# Altium schematic sheet ADC.SchDoc: Wearable ECG Signal Acquisition Device
size A4; DrawnBy: Sineth Jayawardena; Address1: 003 18 bit SAR ADC; Revision: V1; SheetNumber: 4; SheetTotal: 5
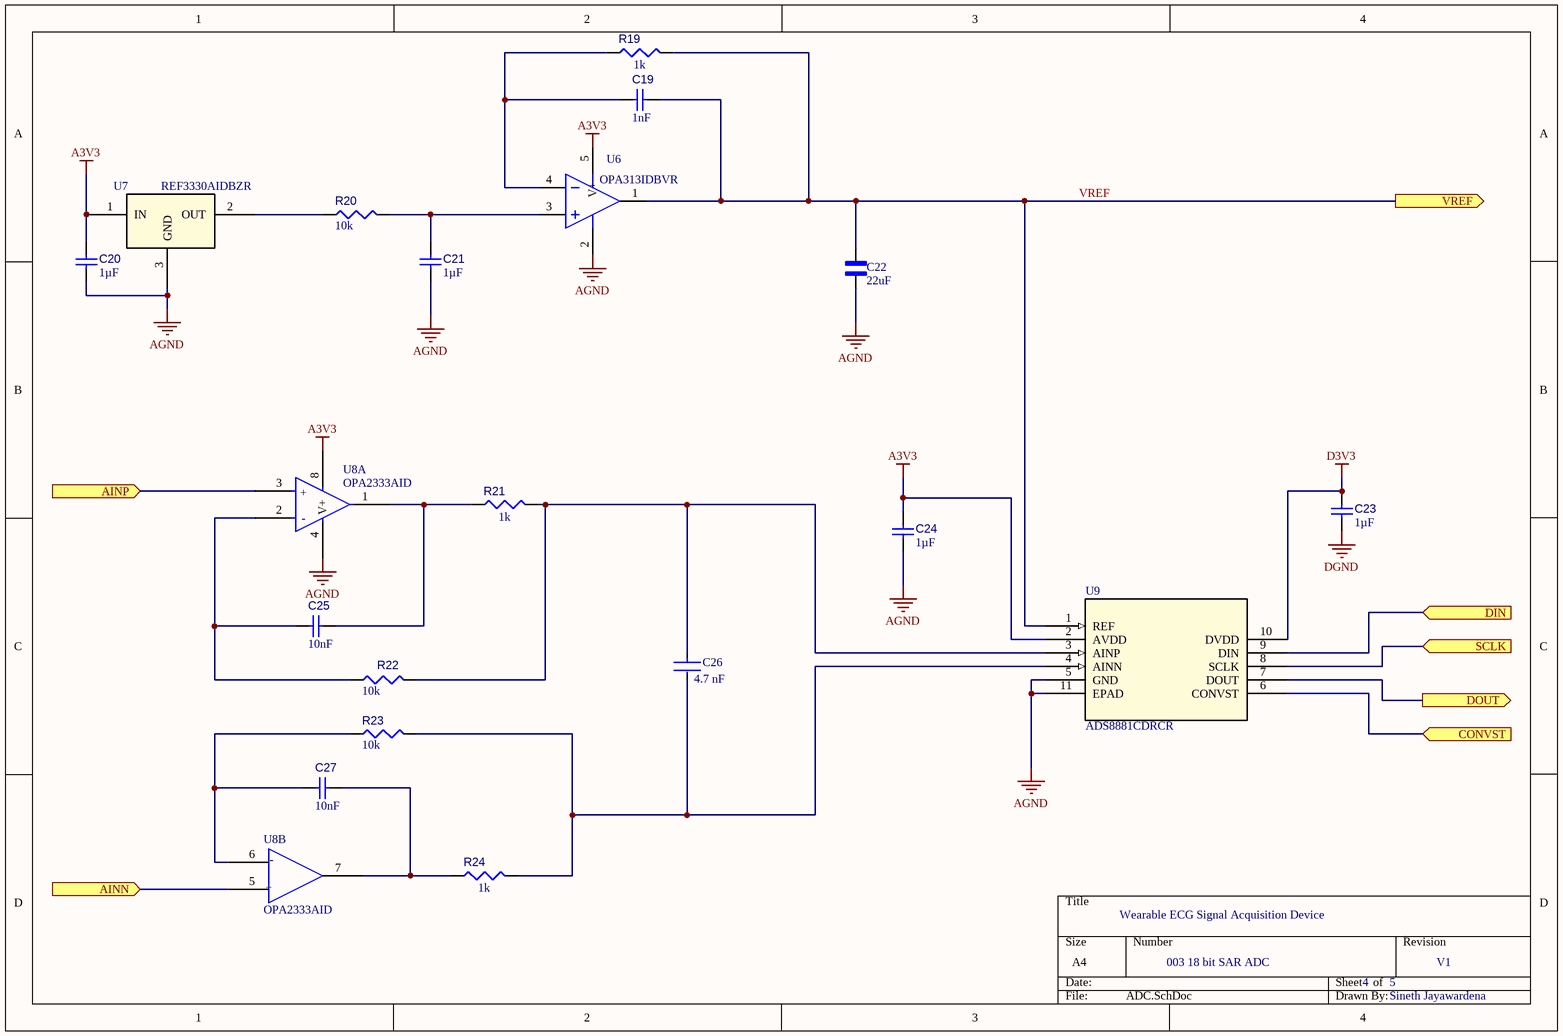
[diagram p0: ADC.SchDoc]

## Parts
C19  value 1nF  [CAPC0402(1005)33_L]  (hidden comment: Capacitor 1nF +/-20% 50V 0402)
C20  value 1µF  [CAPC2013X145X50ML20T25]  (hidden comment: Capacitor 1 uF +/- 10% 25 V 0805)
C21  value 1µF  [CAPC2013X145X50ML20T25]  (hidden comment: Capacitor 1 uF +/- 10% 25 V 0805)
C22  22uF  [22uF_CAPC1608X100N]
C23  value 1µF  [CAPC2013X145X50ML20T25]  (hidden comment: Capacitor 1 uF +/- 10% 25 V 0805)
C24  value 1µF  [CAPC2013X145X50ML20T25]  (hidden comment: Capacitor 1 uF +/- 10% 25 V 0805)
C25  value 10nF  [CAPC0402(1005)60_L]  (hidden comment: Capacitor 10nF +/-20% 50V 0402)
C26  value 4.7 nF  [FP-AC0805-0_85-MFG]  (hidden comment: AC0805KRX7R0BB472)
C27  value 10nF  [CAPC0402(1005)60_L]  (hidden comment: Capacitor 10nF +/-20% 50V 0402)
R19  value 1k  [RESC0805(2012)_L]  (hidden comment: Resistor 1K +/-5% 0805 125 mW)
R20  value 10k  [RESC2013X50X35NL15T15]  (hidden comment: Resistor 10k +/-1% 0805 125 mW)
R21  value 1k  [RESC0805(2012)_L]  (hidden comment: Resistor 1K +/-5% 0805 125 mW)
R22  value 10k  [RESC2013X50X35NL15T15]  (hidden comment: Resistor 10k +/-1% 0805 125 mW)
R23  value 10k  [RESC2013X50X35NL15T15]  (hidden comment: Resistor 10k +/-1% 0805 125 mW)
R24  value 1k  [RESC0805(2012)_L]  (hidden comment: Resistor 1K +/-5% 0805 125 mW)
U6  OPA313IDBVR  [DBV0005A_L]
U7  REF3330AIDBZR  [DBZ3-M]
U8  OPA2333AID  [OPA2333_D8-M]  (parts A,B of 2)
U9  ADS8881CDRCR  [ADC_DRC10_TEX-L]

## Ports
AINN (in, see Overview[2B], INA[4C]), AINP (in, see Overview[2B], INA[4A]), CONVST (in, see Overview[3B], MCU[1C]), DIN (in, see Overview[3B], MCU[1B]), DOUT (out, see Overview[3B], MCU[1C]), SCLK (in, see Overview[3B], MCU[1B]), VREF (out, see Overview[2B], INA[3D])

## Nets
A3V3: C20.2 C24.2 U6.5(V+) U7.1(IN) U8.8(V+) U9.2(AVDD)
AGND: C20.1 C21.1 C22.1 C24.1 U6.2(V-) U7.3(GND) U8.4(V-) U9.5(GND) U9.11(EPAD)
D3V3: C23.2 U9.10(DVDD)
DGND: C23.1
AINN: U8.5(INB+) ; port AINN
AINP: U8.3(INA+) ; port AINP
CONVST: U9.6(CONVST) ; port CONVST
DIN: U9.9(DIN) ; port DIN
DOUT: U9.7(DOUT) ; port DOUT
SCLK: U9.8(SCLK) ; port SCLK
VREF: C19.2 C22.2 R19.2 U6.1(OUT) U9.1(REF) ; port VREF
NetC19_1: C19.1 R19.1 U6.4(IN-)
NetC21_2: C21.2 R20.2 U6.3(IN+)
NetC25_1: C25.1 R22.1 U8.2(INA-)
NetC25_2: C25.2 R21.1 U8.1(OUTA)
NetC26_1: C26.1 R21.2 R22.2 U9.3(AINP)
NetC26_2: C26.2 R23.2 R24.2 U9.4(AINN)
NetC27_1: C27.1 R23.1 U8.6(INB-)
NetC27_2: C27.2 R24.1 U8.7(OUTB)
NetR20_1: R20.1 U7.2(OUT)

## Notes on the sheet
- (in symbol OPA2333AID, part A) +; -
- (in symbol OPA2333AID, part B) -; +

## Library data of the parts
C19 = CMP-001-00066-3: Chip Capacitor, 1nF +/-20%, 50V, 0402, Thickness 0.33 mm; Tolerance: 10%; Case/Package: 0402; Pins: 2; Min Operating Temperature: -55°C; Max Operating Temperature: 85°C; Voltage Rating: 50V; Mounting Technology: SMT
C20 C21 C23 C24 = CMP-001-00010-6: Chip Capacitor, 1 uF, +/-10%, 25 V, 0805 (2012 Metric); Capacitor Type: Ceramic; Voltage Rating: 25V; RoHS Compliant: True; Pins: 2; Mounting Technology: SM; Max Operating Temperature: 125°C; Min Operating Temperature: -55°C; Tolerance: 10%; Case/Package: 0805
C22 = 22uF: SMD capacitor X5R(EIA) with capacitance 22uF Tol.20%. Rated voltage 10Vdc 85C; MF: Murata Electronics; MP: GRM188R61A226ME15D; SnapEDA_Link: https://www.snapeda.com/parts/GRM188R61A226ME15D/Murata+Electronics+North+America/view-part/?ref=snap; Package: 1608 Murata; Value: *; Check_prices: https://www.snapeda.com/parts/GRM188R61A226ME15D/Murata+Electronics+North+America/view-part/?ref=eda
C25 C27 = CMP-001-00069-3: Chip Capacitor, 10nF +/-20%, 50V, 0402, Thickness 0.6 mm; Tolerance: 5%; Max Operating Temperature: 85°C; Pins: 2; Case/Package: 0402; Voltage Rating: 50V; Min Operating Temperature: -55°C; Mounting Technology: SMT
C26 = CMP-03422-000574-1: CAP CER 4700PF 100V X7R 0805; Manufacturer: Yageo; Tolerance: 0.1; Temperature Coefficient: 15%; Automotive Grade: Grade 1; Material: Ceramic; Temperature Range Low: -55°C; Digikey Description: CAP CER 4700PF 100V X7R 0805; Lead Free: Yes; Capacitance: 4.7 nF; Ipc Land Pattern Name: CAPC200125X85; Voltage Rating: 100 V; Category: Cap; Footprint Url: http://www.yageo.com/exep/pages/download/literatures/UPY-C_GEN_24.pdf; Device Class L1: Passive Components; Temperature Characteristic: X7R; ComponentLink2URL: http://www.yageo.com/documents/recent/UPY-AC_NP0X7R_16V-to-630V_12.pdf; ComponentLink2Description: Datasheet; Automotive: Yes; Temperature Range High: +125°C; Manufacturer Part Number: AC0805KRX7R0BB472; Device Class L3: Ceramic Capacitors; Device Class L2: Capacitors; Temperature: -55°C to +125°C; Octopart: https://octopart.com/ac0805krx7r0bb472-yageo-78873433; Package: AC0805-0.85; RoHS: TRUE; Height: 0.95mm
R19 R21 R24 = CMP-009-00118-3: Chip Resistor, 1 kOhms, +/-5%, 125 mW, -55 to 155 degC, 0805; Tolerance: 5%; Power: 125mW; Case/Package: 0805; Pins: 2; Min Operating Temperature: -55°C; Max Operating Temperature: 155°C
R20 R22 R23 = CMP-009-00018-5: Chip Resistor, 10 KOhm, +/- 1%, 125 mW, -55 to 155 degC, 0805 (2012 Metric); Power: 125mW; Voltage Rating: 150V; Tolerance: 1%; Pins: 2; Min Operating Temperature: -55°C; Case/Package: 0805; Max Operating Temperature: 155°C; RoHS Compliant: True; Mounting Technology: SM
U6 = CMP-0810-00004-2: 1-MHz, Micropower, Low-Noise, Rail-to-Rail I/O Operational Amplifier, 1.8 to 5.5 V, -40 to 125 degC, 5-pin SOT23 (DBV5), Green (RoHS & no Sb/Br); Manufacturer: Texas Instruments; Offset Drift(Typ)(uV/C): 2; Rating: Catalog; Packing: LARGE T&R; SubFamily: Low Input Bias Current Amp (<=10pA), Low Power Amp (<=500uA); Number of Channels: 1; Vio (25C)(Max)(mV): 2.5; Total Supply Voltage(Min)(+5V is 5, +/-5V is 10): 1.8; CMRR(Min)(dB): 70; Total Supply Voltage(Max)(+5V is 5, +/-5V is 10): 5.5; Iq per channel(Max)(mA): 0.06; Slew Rate(Typ)(V/us): 0.5; ComponentLink1Description: Manufacturer URL; PackageVersion: 4073253-4/K, 03/2006; ComponentLink2Description: Datasheet; Code_JEDEC: MO-178; GBW(Typ)(MHz): 1; Eco-Plan: Green (RoHS & no Sb/Br); ComponentLink3Description: Package Specification; PartNumber: OPA313IDBVR; PackageReference: DBV0005A; Mounting Technology: Surface Mount; PackageDescription: 5-Pin Plastic Small Outline, Body 1.6 x 2.9 mm, Pitch 0.95 mm; ComponentLink1URL: http://www.ti.com/; DatasheetVersion: SBOS649C; ComponentLink2URL: http://www.ti.com/lit/ds/symlink/opa313.pdf; ComponentLink3URL: http://www.ti.com/litv/pdf/mpds018i
U7 = REF3330AIDBZR: 30-ppm/Â°C drift, 3.9ÂµA, 3-pin SOT-23, 3-pin SC70, 8-pin UQFN series voltage reference 3-SOT-23 -40 to 125; Manufacturer_Name: Texas Instruments; Copyright: Copyright (C) 2025 Ultra Librarian. All rights reserved.; Manufacturer_Part_Number: REF3330AIDBZR; Datasheet: https://www.ti.com/lit/gpn/ref3330; RefDes: RefDes; Type: Type
U8 = OPA2333AID: 1.8-V, 17-ÂµA, two-channel, micropower zero-drift CMOS operational amplifier 8-SOIC -40 to 125; Manufacturer_Name: Texas Instruments; Copyright: Copyright (C) 2025 Ultra Librarian. All rights reserved.; Manufacturer_Part_Number: OPA2333AID; RefDes: RefDes; Type: Type
U9 = ADS8881CDRCR: 18-Bit, 1-MSPS, 1-Ch SAR ADC with True-Differential Input, SPI Interface and Daisy-Chain 10-VSON 0 to 70; Manufacturer_Name: Texas Instruments; Copyright: Copyright (C) 2025 Ultra Librarian. All rights reserved.; Manufacturer_Part_Number: ADS8881CDRCR; Datasheet: https://www.ti.com/lit/gpn/ads8881; RefDes: RefDes; Type: Type